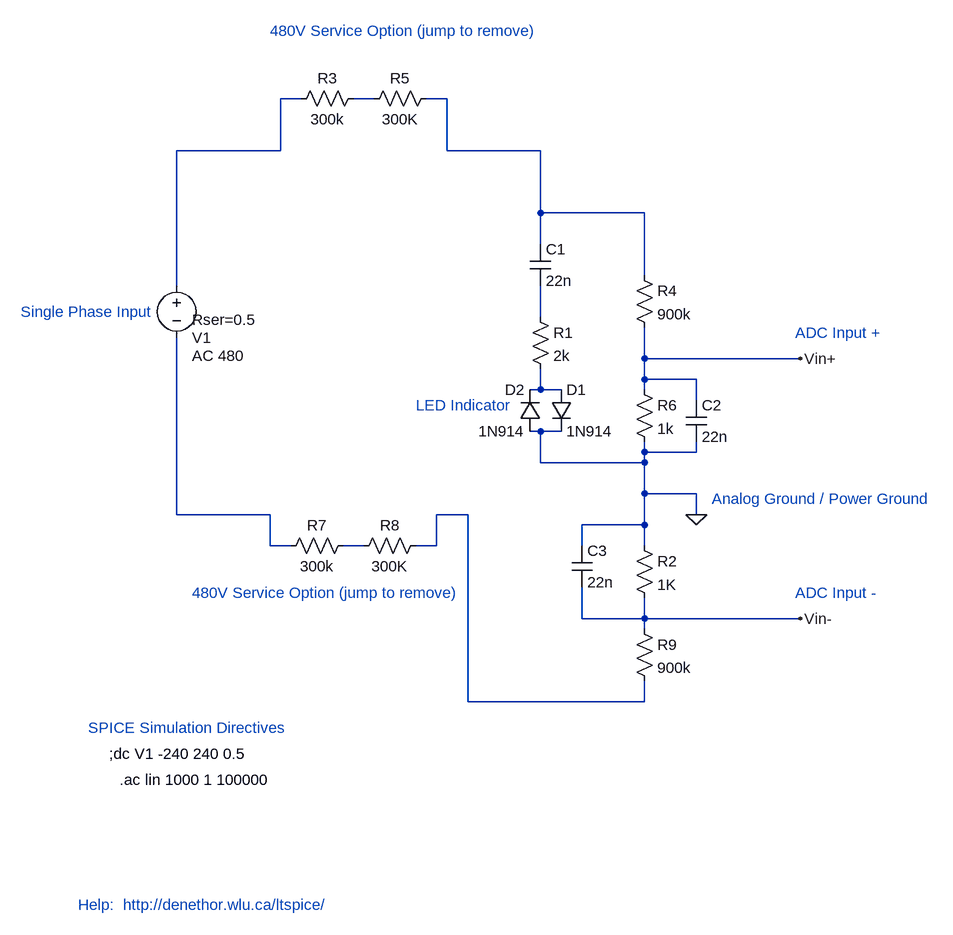
[diagram p0: schematic 3phasemeter.asc]
3phasemeter.asc, the LTspice schematic file:
Version 4
SHEET 1 1356 1016
WIRE -1008 -384 -1040 -384
WIRE -896 -384 -928 -384
WIRE -784 -384 -816 -384
WIRE -1040 -304 -1040 -384
WIRE -1040 -304 -1200 -304
WIRE -784 -304 -784 -384
WIRE -640 -304 -784 -304
WIRE -640 -208 -640 -304
WIRE -480 -208 -640 -208
WIRE -640 -160 -640 -208
WIRE -480 -112 -480 -208
WIRE -1200 -96 -1200 -304
WIRE -640 -48 -640 -96
WIRE -480 16 -480 -32
WIRE -240 16 -480 16
WIRE -480 48 -480 16
WIRE -400 48 -480 48
WIRE -640 64 -640 32
WIRE -640 64 -656 64
WIRE -608 64 -640 64
WIRE -480 64 -480 48
WIRE -400 80 -400 48
WIRE -640 128 -656 128
WIRE -608 128 -640 128
WIRE -480 160 -480 144
WIRE -400 160 -400 144
WIRE -400 160 -480 160
WIRE -640 176 -640 128
WIRE -480 176 -480 160
WIRE -480 176 -640 176
WIRE -480 224 -480 176
WIRE -400 224 -480 224
WIRE -1200 256 -1200 -16
WIRE -1056 256 -1200 256
WIRE -752 256 -800 256
WIRE -400 256 -400 224
WIRE -480 272 -480 224
WIRE -480 272 -576 272
WIRE -1056 304 -1056 256
WIRE -1024 304 -1056 304
WIRE -912 304 -944 304
WIRE -800 304 -800 256
WIRE -800 304 -832 304
WIRE -576 304 -576 272
WIRE -480 304 -480 272
WIRE -576 416 -576 368
WIRE -480 416 -480 384
WIRE -480 416 -576 416
WIRE -240 416 -480 416
WIRE -480 432 -480 416
WIRE -752 544 -752 256
WIRE -480 544 -480 512
WIRE -480 544 -752 544
FLAG -400 256 0
FLAG -240 16 Vin+
FLAG -240 416 Vin-
SYMBOL res -496 -128 R0
SYMATTR InstName R4
SYMATTR Value 900k
SYMBOL res -496 48 R0
SYMATTR InstName R6
SYMATTR Value 1k
SYMBOL voltage -1200 -112 R0
WINDOW 0 24 96 Left 2
WINDOW 3 24 16 Left 2
WINDOW 39 24 68 Left 2
WINDOW 123 24 124 Left 2
SYMATTR InstName V1
SYMATTR Value ""
SYMATTR SpiceLine Rser=0.5
SYMATTR Value2 AC 480
SYMBOL cap -656 -160 R0
SYMATTR InstName C1
SYMATTR Value 22n
SYMBOL res -656 -64 R0
SYMATTR InstName R1
SYMATTR Value 2k
SYMBOL diode -624 64 R0
SYMATTR InstName D1
SYMATTR Value 1N914
SYMBOL diode -640 128 R180
WINDOW 0 24 64 Left 2
WINDOW 3 24 0 Left 2
SYMATTR InstName D2
SYMATTR Value 1N914
SYMBOL res -912 -400 R90
WINDOW 0 0 56 VBottom 2
WINDOW 3 32 56 VTop 2
SYMATTR InstName R3
SYMATTR Value 300k
SYMBOL res -800 -400 R90
WINDOW 0 0 56 VBottom 2
WINDOW 3 32 56 VTop 2
SYMATTR InstName R5
SYMATTR Value 300K
SYMBOL cap -416 80 R0
SYMATTR InstName C2
SYMATTR Value 22n
SYMBOL res -928 288 R90
WINDOW 0 0 56 VBottom 2
WINDOW 3 32 56 VTop 2
SYMATTR InstName R7
SYMATTR Value 300k
SYMBOL res -816 288 R90
WINDOW 0 0 56 VBottom 2
WINDOW 3 32 56 VTop 2
SYMATTR InstName R8
SYMATTR Value 300K
SYMBOL res -496 288 R0
SYMATTR InstName R2
SYMATTR Value 1K
SYMBOL cap -592 304 R0
SYMATTR InstName C3
SYMATTR Value 22n
SYMBOL res -496 416 R0
SYMATTR InstName R9
SYMATTR Value 900k
TEXT -1352 856 Left 2 ;Help:  http://denethor.wlu.ca/ltspice/
TEXT -1336 584 Left 2 ;SPICE Simulation Directives
TEXT -1304 624 Left 2 !;dc V1 -240 240 0.5
TEXT -832 88 Left 2 ;LED Indicator
TEXT -376 232 Left 2 ;Analog Ground / Power Ground
TEXT -248 -24 Left 2 ;ADC Input +
TEXT -1056 -488 Left 2 ;480V Service Option (jump to remove)
TEXT -248 376 Left 2 ;ADC Input -
TEXT -1176 376 Left 2 ;480V Service Option (jump to remove)
TEXT -1440 -56 Left 2 ;Single Phase Input
TEXT -1288 664 Left 2 !.ac lin 1000 1 100000

The netlist it stands for:
* 3phasemeter.asc
R4 N003 Vin+ 900k
R6 Vin+ 0 1k
V1 N001 N006 AC 480 Rser=0.5
C1 N003 N004 22n
R1 N004 N005 2k
D1 N005 0 1N914
D2 0 N005 1N914
R3 N002 N001 300k
R5 N003 N002 300K
C2 Vin+ 0 22n
R7 N008 N006 300k
R8 N007 N008 300K
R2 0 Vin- 1K
C3 0 Vin- 22n
R9 Vin- N007 900k
.model D D
.lib standard.dio
* Help:  http://denethor.wlu.ca/ltspice/
* SPICE Simulation Directives
;dc V1 -240 240 0.5
* LED Indicator
* Analog Ground / Power Ground
* ADC Input +
* 480V Service Option (jump to remove)
* ADC Input -
* 480V Service Option (jump to remove)
* Single Phase Input
.ac lin 1000 1 100000
.backanno
.end